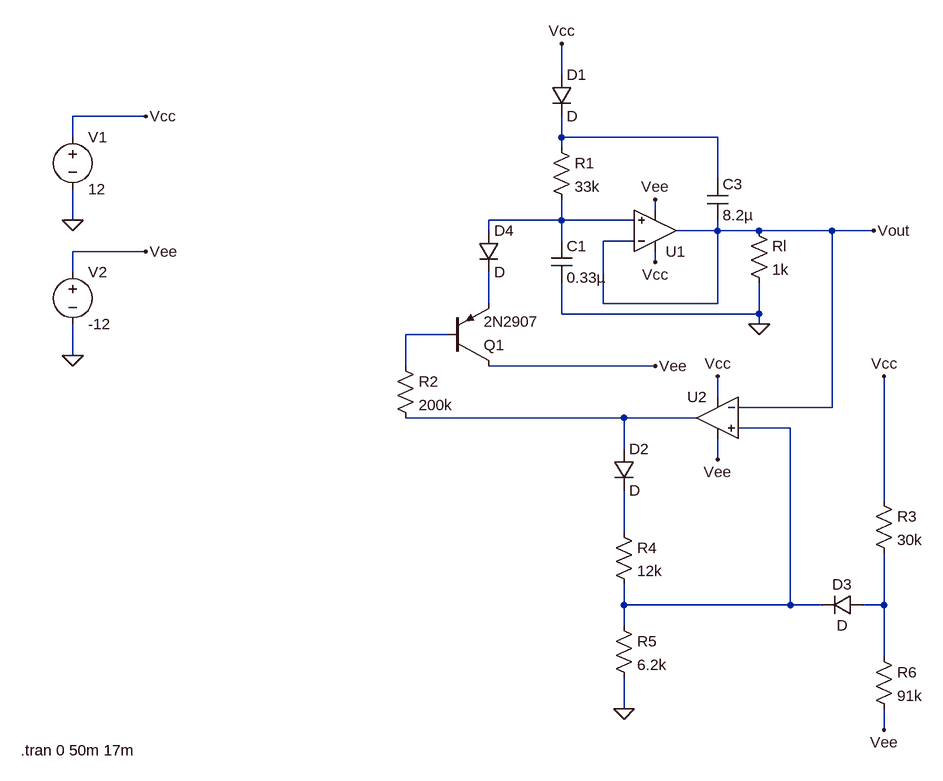
[diagram p0: schematic PS2.asc]
PS2.asc, the LTspice schematic file:
Version 4
SHEET 1 880 1128
WIRE 64 32 64 -16
WIRE -576 96 -688 96
WIRE -688 128 -688 96
WIRE 64 128 64 96
WIRE 304 128 64 128
WIRE 64 144 64 128
WIRE 304 192 304 128
WIRE 208 240 208 224
WIRE -688 256 -688 208
WIRE 64 256 64 224
WIRE 64 256 -48 256
WIRE 176 256 64 256
WIRE -48 272 -48 256
WIRE 304 272 304 256
WIRE 304 272 240 272
WIRE 368 272 304 272
WIRE 480 272 368 272
WIRE 544 272 480 272
WIRE 64 288 64 256
WIRE 176 288 128 288
WIRE -576 304 -688 304
WIRE 208 320 208 304
WIRE -688 336 -688 304
WIRE -48 384 -48 336
WIRE 128 384 128 288
WIRE 304 384 304 272
WIRE 304 384 128 384
WIRE 64 400 64 352
WIRE 368 400 368 352
WIRE 368 400 64 400
WIRE 368 416 368 400
WIRE -112 432 -176 432
WIRE -688 464 -688 416
WIRE -176 480 -176 432
WIRE 208 480 -48 480
WIRE 304 528 304 496
WIRE 480 544 480 272
WIRE 480 544 336 544
WIRE 160 560 -176 560
WIRE 272 560 160 560
WIRE 416 576 336 576
WIRE 160 608 160 560
WIRE 304 624 304 592
WIRE 560 688 560 496
WIRE 160 736 160 672
WIRE 160 848 160 816
WIRE 416 848 416 576
WIRE 416 848 160 848
WIRE 464 848 416 848
WIRE 560 848 560 768
WIRE 560 848 528 848
WIRE 160 880 160 848
WIRE 560 928 560 848
WIRE 160 1008 160 960
WIRE 560 1040 560 1008
FLAG -688 256 0
FLAG -688 464 0
FLAG -576 304 Vee
FLAG -576 96 Vcc
FLAG 208 320 Vcc
FLAG 208 224 Vee
FLAG 64 -16 Vcc
FLAG 208 480 Vee
FLAG 368 416 0
FLAG 304 496 Vcc
FLAG 304 624 Vee
FLAG 544 272 Vout
FLAG 160 1008 0
FLAG 560 1040 Vee
FLAG 560 496 Vcc
SYMBOL res 48 128 R0
SYMATTR InstName R1
SYMATTR Value 33k
SYMBOL cap 48 288 R0
SYMATTR InstName C1
SYMATTR Value 0.33µ
SYMBOL voltage -688 112 R0
WINDOW 123 0 0 Left 0
WINDOW 39 0 0 Left 0
SYMATTR InstName V1
SYMATTR Value 12
SYMBOL voltage -688 320 R0
WINDOW 123 0 0 Left 0
WINDOW 39 0 0 Left 0
SYMATTR InstName V2
SYMATTR Value -12
SYMBOL res 352 256 R0
SYMATTR InstName Rl
SYMATTR Value 1k
SYMBOL pnp -112 480 M180
SYMATTR InstName Q1
SYMATTR Value 2N2907
SYMBOL cap 288 192 R0
SYMATTR InstName C3
SYMATTR Value 8.2µ
SYMBOL res -192 464 R0
SYMATTR InstName R2
SYMATTR Value 200k
SYMBOL res 144 720 R0
SYMATTR InstName R4
SYMATTR Value 12k
SYMBOL res 144 864 R0
SYMATTR InstName R5
SYMATTR Value 6.2k
SYMBOL OpAmps\\UniversalOpamp2 208 272 M180
SYMATTR InstName U1
SYMBOL OpAmps\\UniversalOpamp2 304 560 M0
SYMATTR InstName U2
SYMBOL res 544 672 R0
SYMATTR InstName R3
SYMATTR Value 30k
SYMBOL res 544 912 R0
SYMATTR InstName R6
SYMATTR Value 91k
SYMBOL diode 48 32 R0
SYMATTR InstName D1
SYMBOL diode 144 608 R0
SYMATTR InstName D2
SYMBOL diode 528 832 R90
WINDOW 0 0 32 VBottom 2
WINDOW 3 32 32 VTop 2
SYMATTR InstName D3
SYMBOL diode -64 272 R0
SYMATTR InstName D4
TEXT -768 1072 Left 2 !.tran 0 50m 17m

The netlist it stands for:
* PS2.asc
R1 N001 N002 33k
C1 N002 0 0.33µ
V1 Vcc 0 12
V2 Vee 0 -12
Rl Vout 0 1k
Q1 Vee N004 N003 0 2N2907
C3 N001 Vout 8.2µ
R2 N004 N005 200k
R4 N007 N006 12k
R5 N006 0 6.2k
XU1 N002 Vout Vcc Vee Vout level.2 Avol=1Meg GBW=10Meg Slew=10Meg ilimit=25m rail=0 Vos=0 phimargin=45 en=0 enk=0 in=0 ink=0 Rin=500Meg  ; pins IN+ IN- V+ V- OUT
XU2 N006 Vout Vcc Vee N005 level.2 Avol=1Meg GBW=10Meg Slew=10Meg ilimit=25m rail=0 Vos=0 phimargin=45 en=0 enk=0 in=0 ink=0 Rin=500Meg  ; pins IN+ IN- V+ V- OUT
R3 Vcc N008 30k
R6 N008 Vee 91k
D1 Vcc N001 D
D2 N005 N007 D
D3 N008 N006 D
D4 N002 N003 D
.model D D
.lib standard.dio
.model NPN NPN
.model PNP PNP
.lib standard.bjt
.tran 0 50m 17m
.lib UniversalOpamps2.sub
.backanno
.end